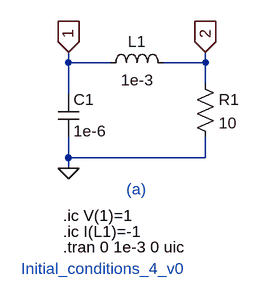
[diagram p0: schematic Initial_conditions_v0.asc]
Initial_conditions_v0.asc, the LTspice schematic file:
Version 4
SHEET 1 880 680
WIRE 128 112 128 96
WIRE 192 112 128 112
WIRE 336 112 336 96
WIRE 336 112 272 112
WIRE 336 144 336 112
WIRE 128 160 128 112
WIRE 128 256 128 224
WIRE 336 256 336 224
WIRE 336 256 128 256
WIRE 128 272 128 256
FLAG 128 272 0
FLAG 128 96 1
IOPIN 128 96 In
FLAG 336 96 2
IOPIN 336 96 In
SYMBOL ind 176 128 R270
WINDOW 0 32 56 VTop 2
WINDOW 3 5 56 VBottom 2
SYMATTR InstName L1
SYMATTR Value 1e-3
SYMATTR SpiceLine Rser=0
SYMBOL cap 112 160 R0
SYMATTR InstName C1
SYMATTR Value 1e-6
SYMBOL res 320 128 R0
SYMATTR InstName R1
SYMATTR Value 10
TEXT 120 344 Left 2 !.ic V(1)=1
TEXT 120 392 Left 2 !.tran 0 1e-3 0 uic
TEXT 56 424 Left 2 ;Initial_conditions_4_v0
TEXT 120 368 Left 2 !.ic I(L1)=-1
TEXT 216 304 Left 2 ;(a)

The netlist it stands for:
* Initial_conditions_v0.asc
L1 1 2 1e-3 Rser=0
C1 1 0 1e-6
R1 2 0 10
.ic V(1)=1
.tran 0 1e-3 0 uic
* Initial_conditions_4_v0
.ic I(L1)=-1
* (a)
.backanno
.end